# EAGLE design turbo (EAGLE 7.6.0)
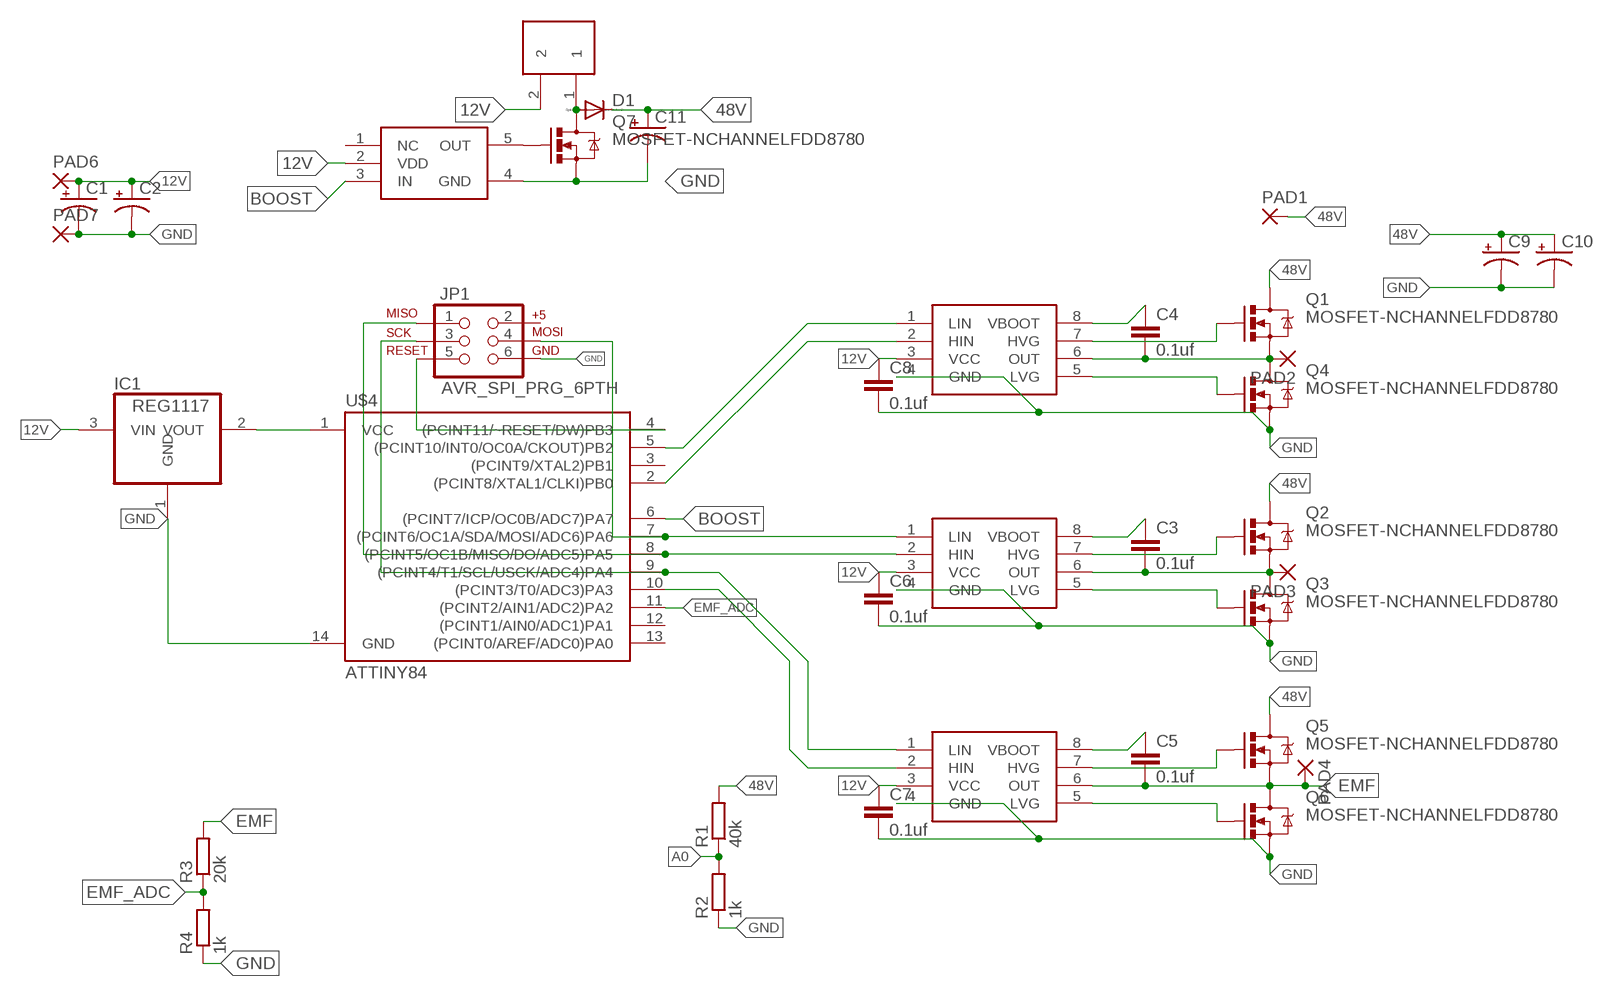
[diagram p0: schematic, sheet 1]

## Parts
C1  CPOL-USE7.5-18  [E7,5-18]
C2  CPOL-USE7.5-18  [E7,5-18]
C3  0.1uf  C-EUC0603  [C0603]
C4  0.1uf  C-EUC0603  [C0603]
C5  0.1uf  C-EUC0603  [C0603]
C6  0.1uf  C-EUC0603  [C0603]
C7  0.1uf  C-EUC0603  [C0603]
C8  0.1uf  C-EUC0603  [C0603]
C9  CPOL-USE7.5-18  [E7,5-18]
C10  CPOL-USE7.5-18  [E7,5-18]
C11  CPOL-USE7.5-18  [E7,5-18]
D1  DIODE-TO220V  [TO220ACS]
IC1  REG1117  [SOT223]
JP1  AVR_SPI_PRG_6PTH  [2X3]
PAD1  WIREPADSMD5-2,5  [5-2,5]
PAD2  WIREPADSMD5-2,5  [5-2,5]
PAD3  WIREPADSMD5-2,5  [5-2,5]
PAD4  WIREPADSMD5-2,5  [5-2,5]
PAD6  WIREPADSMD5-2,5  [5-2,5]
PAD7  WIREPADSMD5-2,5  [5-2,5]
Q1  MOSFET-NCHANNELFDD8780  [DPAK]
Q2  MOSFET-NCHANNELFDD8780  [DPAK]
Q3  MOSFET-NCHANNELFDD8780  [DPAK]
Q4  MOSFET-NCHANNELFDD8780  [DPAK]
Q5  MOSFET-NCHANNELFDD8780  [DPAK]
Q6  MOSFET-NCHANNELFDD8780  [DPAK]
Q7  MOSFET-NCHANNELFDD8780  [DPAK]
R1  40k  R-EU_R0603  [R0603]
R2  1k  R-EU_R0603  [R0603]
R3  20k  R-EU_R0603  [R0603]
R4  1k  R-EU_R0603  [R0603]
U$1  L6387  [SOIC8]
U$2  L6387  [SOIC8]
U$3  L6387  [SOIC8]
U$4  ATTINY84  [SO14]
U$5  2310  [2310]
U$6  MCP1415  [SOT23-5]

## Nets
12V: C1.+ C2.+ C6.1 C7.1 C8.1 IC1.3(VIN) PAD6.1(P) U$1.3(VCC) U$2.3(VCC) U$3.3(VCC) U$5.2 U$6.2(VDD)
48V: C9.+ C10.+ C11.+ D1.C PAD1.1(P) Q1.4(D) Q2.4(D) Q5.4(D) R1.2
A0: R1.1 R2.2
BOOST: U$4.6((PCINT7/ICP/OC0B/ADC7)PA7) U$6.3(IN)
EMF: C5.2 PAD4.1(P) Q5.3(S) Q6.4(D) R3.2 U$3.6(OUT)
EMF_ADC: R3.1 R4.2 U$4.11((PCINT2/AIN1/ADC2)PA2)
GND: C1.- C2.- C6.2 C7.2 C8.2 C9.- C10.- C11.- IC1.1(GND) JP1.6 PAD7.1(P) Q3.3(S) Q4.3(S) Q6.3(S) Q7.3(S) R2.1 R4.1 U$1.4(GND) U$2.4(GND) U$3.4(GND) U$4.14(GND) U$6.4(GND)
N$1: C4.2 PAD2.1(P) Q1.3(S) Q4.4(D) U$1.6(OUT)
N$2: C3.2 PAD3.1(P) Q2.3(S) Q3.4(D) U$2.6(OUT)
N$3: Q3.1(G) U$2.5(LVG)
N$4: Q4.1(G) U$1.5(LVG)
N$5: Q1.1(G) U$1.7(HVG)
N$6: IC1.2(VOUT) U$4.1(VCC)
N$7: C5.1 U$3.8(VBOOT)
N$8: Q2.1(G) U$2.7(HVG)
N$10: Q6.1(G) U$3.5(LVG)
N$11: Q5.1(G) U$3.7(HVG)
N$12: C3.1 U$2.8(VBOOT)
N$13: C4.1 U$1.8(VBOOT)
N$14: JP1.3 U$3.1(LIN) U$4.9((PCINT4/T1/SCL/USCK/ADC4)PA4)
N$15: U$3.2(HIN) U$4.10((PCINT3/T0/ADC3)PA3)
N$16: JP1.1 U$2.2(HIN) U$4.8((PCINT5/OC1B/MISO/DO/ADC5)PA5)
N$17: JP1.4 U$2.1(LIN) U$4.7((PCINT6/OC1A/SDA/MOSI/ADC6)PA6)
N$19: U$1.1(LIN) U$4.5((PCINT10/INT0/OC0A/CKOUT)PB2)
N$20: JP1.5 U$4.4((PCINT11/~RESET/DW)PB3)
N$21: D1.A Q7.4(D) U$5.1
N$22: U$1.2(HIN) U$4.2((PCINT8/XTAL1/CLKI)PB0)
N$23: Q7.1(G) U$6.5(OUT)
Unconnected: JP1.2 U$4.3((PCINT9/XTAL2)PB1) U$4.12((PCINT1/AIN0/ADC1)PA1) U$4.13((PCINT0/AREF/ADC0)PA0) U$6.1(NC)

## Library data of the parts
C1 C2 C9-C11 = adafruit:CPOL-US: POLARIZED CAPACITOR, American symbol
C3-C8 = rcl:C-EU: CAPACITOR, European symbol
D1 = diode:DIODE-: DIODE
IC1 = burr-brown:REG1117: 800mA and 1A Low Dropout (LDO) Positive Regulator 1.8V, 2.5V, 2.85V, 3.3V, 5V, and Adj; MPN: REG1117; OC_FARNELL: 1097566; OC_NEWARK: 14P6981
JP1 = SparkFun-Connectors:AVR_SPI_PRG_6: AVR ISP 6 Pin This is the reduced ISP connector for AVR programming. Common on Arduino. This footprint will take up less PCB space and can be used with a 10-pin to 6-pin adapter such as SKU: BOB-08508 **Special note about "TEST_POINT" package. The stop mask is on the top side, so if you want your programming test points to be on the bottom of your board, make sure to place this package on the bottom side of the board. This also ensure that the orientation to program from the bottom side will be correct.
PAD1-PAD4 PAD6 PAD7 = wirepad:WIREPAD: Wire PAD connect wire on PCB
Q1-Q7 = SparkFun-DiscreteSemi:MOSFET-NCHANNEL: Common NMOSFET Parts MFG P/N Store ID Prod ID FDD8780 TRANS-09984 SI7820DN TRANS-11055 FDS6630A IC-08089 2N7002PW TRANS-11151 FQP30N06L COM-10213 TRANS-10060 BSS123LT1G TRANS-08345 BSS138 TRANS-00830 BS170 2N7000; PROD_ID: TRANS-09984
R1-R4 = rcl:R-EU_: RESISTOR, European symbol
U$1-U$3 = TheLibrary:L6387
U$4 = SparkFun-DigitalIC:ATTINY84: Atmel 14-pin 2/4/8kB flash uC; PROD_ID: IC-11285
U$5 = TheLibrary:2310
U$6 = TheLibrary:MCP1415

## Net classes
0 default: width 0.635 mm

## Board
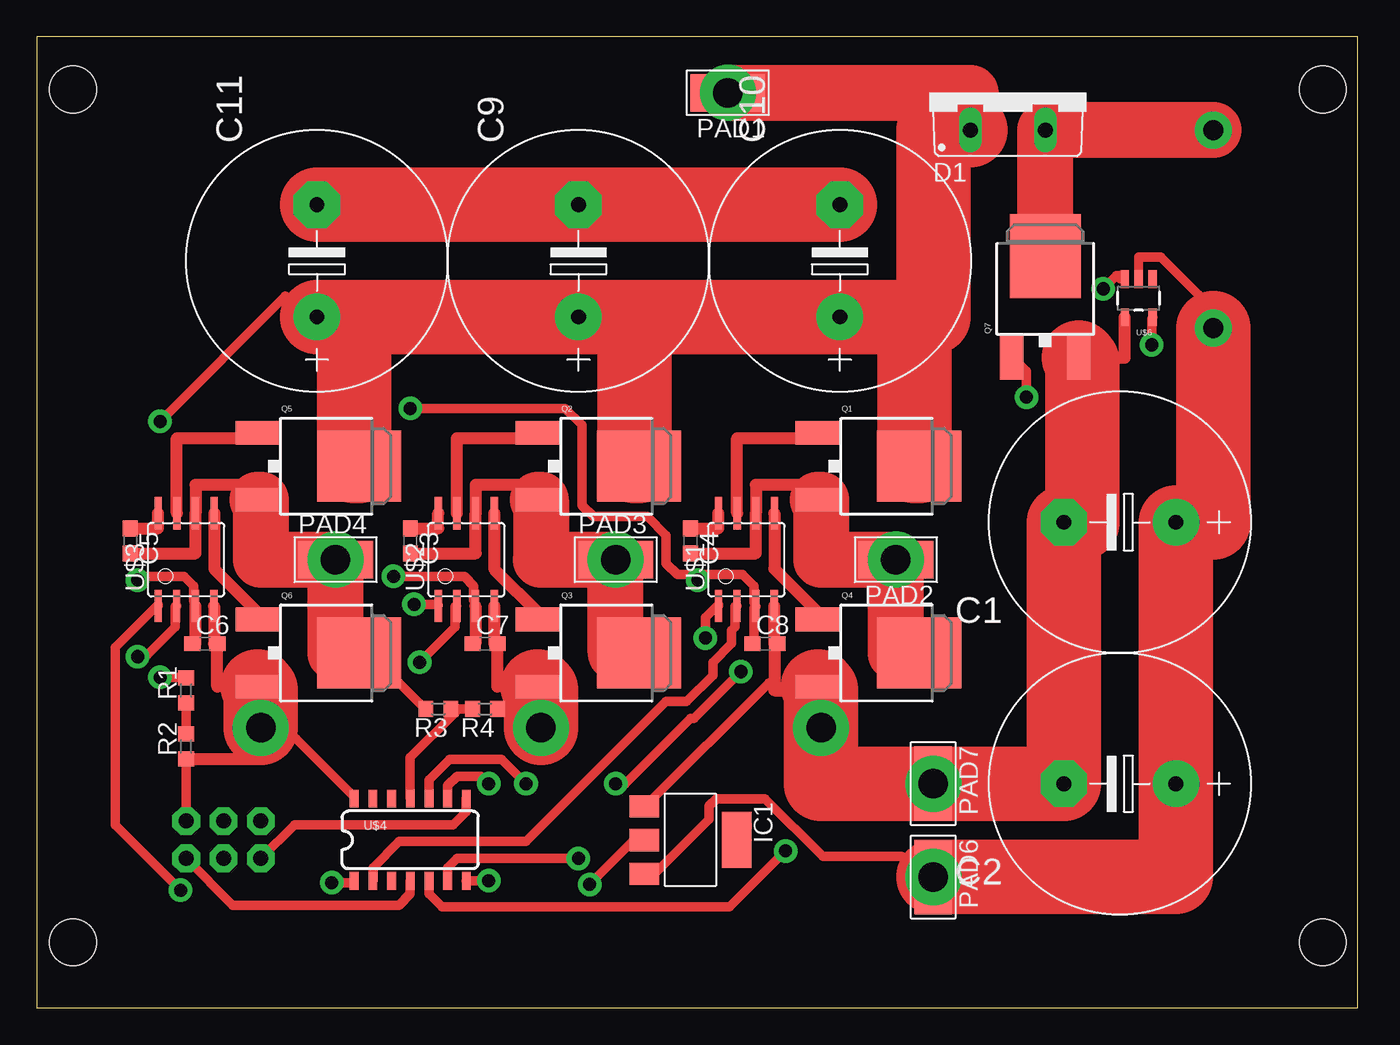
[diagram p1: board, top side]
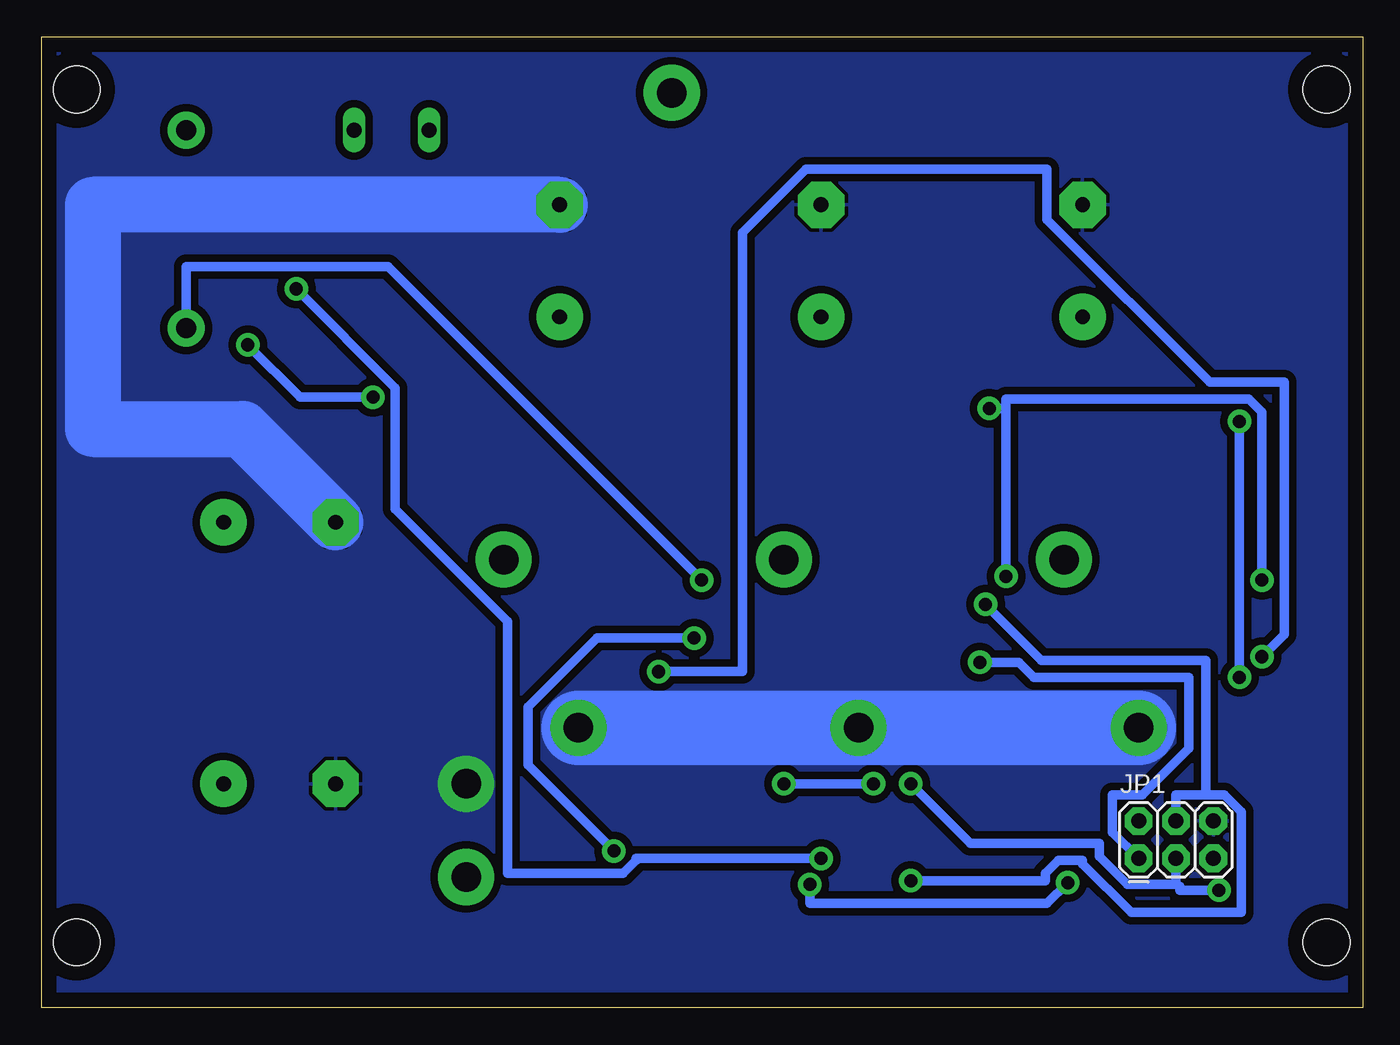
[diagram p2: board, bottom side, seen from below]

Size 89.84 x 66.03 mm. Coordinates in mm from the lower left corner, seen from the top.
Outline: 0,0 89.84,0 89.84,66.03 0,66.03 0,0
Copper layers (1*16): Top 0.035mm / dielectric 1.5mm / Bottom 0.035mm
Design rules "default *": minimum track width 20mil, minimum drill 35mil, track to track 20mil, track to pad 20mil, pad to pad 20mil, via to via 20mil, smd to smd 20mil, copper to edge 40mil, drill to drill 13mil, minimum pad ring 10mil, minimum via ring 8mil, stop-mask expansion 4mil, vias tented up to drill 0mil, thermal gap 10mil
Holes 3.17 mm at 2.46,62.46 2.46,4.46 87.46,62.46 87.46,4.46
vRestrict: area 21,9.5 to 29.8,13.3; area 7.6,27.9 to 12.7,33; area 26.7,27.9 to 31.7,33; area 45.7,27.9 to 50.8,33; area 54.6,33.7 to 61,40; area 35.6,33.7 to 41.9,40; area 35.6,21 to 41.9,27.3; area 54.6,21 to 61,27.3; area 16.5,21 to 22.9,27.3; area 42.5,8.3 to 46.4,14.6; area 73.7,47.6 to 76.2,48.9; area 65.4,45.7 to 71.8,52.1; 1 more areas

### Footprints (pad centres in the part's own frame; a part is rotated, then mirrored left to right if it is on the bottom)
E7,5-18 = drill 1.016 pad 3.15: + -3.81,0 | drill 1.016 pad 3.15 octagon: - 3.81,0
C0603 = smd 1.1 x 1: 1 -0.85,0; 2 0.85,0
TO220ACS = drill 1.016 long: A 2.54,-2.54; C -2.54,-2.54
SOT223 = smd 1.499 x 2.007: 1 -2.261,-3.15; 2 0.025,-3.15; 3 2.311,-3.15 | smd 3.81 x 2.007: 4 0,3.15
2X3 = drill 1.016 pad 1.88 octagon: 1 0,0; 2 0,2.54; 3 2.54,0; 4 2.54,2.54; 5 5.08,0; 6 5.08,2.54
5-2,5 = smd 2.54 x 5.08: 1 0,0
DPAK = smd 1.6 x 3: 1 -2.28,-5.31; 3 2.28,-5.31 | smd 4.826 x 5.715: 4 0,1.588
R0603 = smd 1 x 1.1: 1 -0.85,0; 2 0.85,0
SOIC8 = smd 0.5 x 2.2: 1 -1.905,-3.154; 2 -0.645,-3.154; 3 0.625,-3.154; 4 1.895,-3.154; 5 1.905,3.154; 6 0.635,3.154; 7 -0.635,3.154; 8 -1.905,3.154
SO14 = smd 0.6 x 1.2: 1 -3.81,-2.8; 2 -2.54,-2.8; 3 -1.27,-2.8; 4 0,-2.8; 5 1.27,-2.8; 6 2.54,-2.8; 7 3.81,-2.8; 8 3.81,2.8; 9 2.54,2.8; 10 1.27,2.8; 11 0,2.8; 12 -1.27,2.8; 13 -2.54,2.8; 14 -3.81,2.8
2310 = drill 1.346 pad 2.54: 1 0,0; 2 13.462,0
SOT23-5 = smd 0.55 x 1.2: 1 -0.95,-1.3; 2 0,-1.3; 3 0.95,-1.3; 4 0.95,1.3; 5 -0.95,1.3

### Placement (x,y rotation side)
C1  73.66,33.02 180 top
C2  73.66,15.24 180 top
C3  25.4,31.75 270 top
C4  44.45,31.75 270 top
C5  6.35,31.75 270 top
C6  11.43,24.77 0 top
C7  30.48,24.77 0 top
C8  49.53,24.77 0 top
C9  36.83,50.8 90 top
C10  54.61,50.8 90 top
C11  19.05,50.8 90 top
D1  66.04,62.23 0 top
IC1  44.45,11.43 270 top
JP1  15.24,10.16 0 bottom
PAD1  46.99,62.23 90 top
PAD2  58.42,30.48 90 top
PAD3  39.37,30.48 270 top
PAD4  20.32,30.48 270 top
PAD6  60.96,8.89 180 top
PAD7  60.96,15.24 180 top
Q1  58.42,36.83 270 top
Q2  39.37,36.83 270 top
Q3  39.37,24.13 270 top
Q4  58.42,24.13 270 top
Q5  20.32,36.83 270 top
Q6  20.32,24.13 270 top
Q7  68.58,49.53 0 top
R1  10.16,21.59 90 top
R2  10.16,17.78 90 top
R3  27.3,20.32 180 top
R4  30.48,20.32 180 top
U$1  48.26,30.48 0 top
U$2  29.21,30.48 0 top
U$3  10.16,30.48 0 top
U$4  25.4,11.43 0 top
U$5  80.01,59.69 270 top
U$6  74.93,48.26 180 top

### Tracks (layer width: path | path; a pad name or v marks a point on that pad's centre or on a via)
12V  (via drill 0.89, 2 pad 3.81)
  Top 0.61: U$6.2 74.93,51.05
  Top 0.635: C8.1 48.77,24.77 48.77,27.18 48.9,27.3 U$1.3 48.77,27.56 48.77,28.7 48.01,29.46 44.96,29.46 | v6.86,29.08 7.11,29.34 10.03,29.34 10.67,28.7 10.67,27.69 U$3.3 | v24.26,29.34 29.08,29.34 29.72,28.7 29.72,27.69 U$2.3 | 44.96,29.46 43.56,29.46 42.8,30.23 42.8,32.13 41.53,33.4 37.85,33.4 37.08,34.16 37.08,39.62 35.94,40.77 v25.4,40.77 | 74.93,51.05 76.45,51.05 78.99,48.51 U$5.2 | IC1.3 41.4,9.14 42.04,9.14 45.72,12.83 45.72,13.72 46.23,14.22 49.53,14.22 53.47,10.29 58.8,10.29 PAD6.1 | v44.96,29.08 44.96,29.46
  Top 0.813: U$3.3 10.79,24.77 C6.1 | U$2.3 29.84,24.77 C7.1
  Top 5.08: PAD6.1 77.47,8.89 C2.+ C1.+ 80.01,33.02 U$5.2
  Bottom 0.635: v6.86,29.08 6.86,40.51 7.75,41.4 24.26,41.4 24.26,40.77 | v24.26,29.34 24.26,40.77 | 24.26,40.77 v25.4,40.77 | v44.96,29.08 66.29,50.42 80.01,50.42 U$5.2
  other vias: 60.96,8.89
48V  (via drill 0.89, 2 pad 3.81)
  Top 0.635: v8.38,22.48 10.16,22.48 R1.2 | v8.38,39.88 16.89,48.39 C11.+
  Top 3.81: Q5.4 22.86,36.83 | PAD1.1 63.5,62.23 D1.C
  Top 5.08: 59.69,46.99 60.96,46.99 60.96,59.69 D1.C | 59.69,46.99 C10.+ 40.64,46.99 | C11.+ 21.59,46.99 | 21.59,46.99 C9.+ 40.64,46.99 | Q1.4 59.69,36.83 59.69,46.99 | Q2.4 40.64,36.83 40.64,46.99 | Q5.4 21.59,36.83 21.59,46.99
  Bottom 0.635: v8.38,39.88 v8.38,22.48
  other vias: 46.99,62.23
A0
  Top 0.635: R1.1 R2.2
BOOST  (via drill 0.89)
  Top 0.61: U$6.3 73.66,49.56 73.66,49.78
  Top 0.635: U$4.6 27.94,9.52 28.57,10.16 v36.83,10.16 | v72.52,48.89 73.41,49.78 73.66,49.78
  Bottom 0.635: v36.83,10.16 49.4,10.16 49.4,10.03 50.29,9.14 58.17,9.14 58.17,26.29 65.79,33.91 65.79,42.16 v72.52,48.89
EMF  (via drill 2 pad 3.81)
  Top 0.635: R3.2 26.42,20.32 23.5,23.24 Q6.4
  Top 0.813: Q5.3 15.01,35.56 10.79,35.56 U$3.6 10.79,30.9 C5.2
  Top 3.81: Q6.4 20.32,24.13 PAD4.1 15.24,30.48 15.24,34.55 Q5.3
  other vias: 20.32,30.48
EMF_ADC
  Top 0.635: R4.2 R3.1 28.45,20.07 25.4,17.02 U$4.11
GND  (via drill 2 pad 3.81)
  Top 0.635: R4.1 34.29,20.32 | U$4.14 21.59,14.35 17.65,18.29 v15.24,19.05 | IC1.1 41.4,13.72 49.78,22.1 50.17,22.1 | R2.1 JP1.6
  Top 0.813: U$3.4 12.05,24.77 C6.2 12.28,21.85 Q6.3 | U$2.4 31.11,24.77 C7.2 31.33,21.85 Q3.3 | U$1.4 50.16,24.77 C8.2 50.17,24.77 50.17,22.1 50.17,21.59 53.11,21.59 Q4.3 | R2.1 15.24,16.93 v15.24,19.05 | Q7.3 73.98,44.22 U$6.4
  Top 5.08: C10.- C9.- C11.- | Q7.3 71.12,43.96 71.12,33.02 C1.- C2.- PAD7.1 53.34,15.24 v53.34,19.05 53.34,21.62 Q4.3 | Q3.3 34.29,21.62 34.29,20.32 v34.29,19.05 | Q6.3 15.24,21.62 v15.24,19.05
  Bottom 3.81: C10.- 86.36,54.61 86.36,39.37 76.2,39.37 C1.-
  Bottom 5.08: v53.34,19.05 v34.29,19.05 v15.24,19.05
  other vias: 60.96,15.24
  pour Bottom (isolate 0.025, rank 6): 0,66.04 0,0 90.17,0 90.17,66.04
N$1  (via drill 2 pad 3.81)
  Top 0.813: C4.2 48.9,30.9 U$1.6 48.9,35.56 53.34,35.56 53.34,34.55
  Top 3.81: Q4.4 58.42,24.13 PAD2.1 53.34,30.48 53.34,34.55 Q1.3
  other vias: 58.42,30.48
N$2  (via drill 2 pad 3.81)
  Top 0.813: Q2.3 34.06,35.56 29.84,35.56 U$2.6 29.84,30.9 C3.2
  Top 3.81: Q3.4 39.37,24.13 PAD3.1 34.29,30.48 34.29,34.55 Q2.3
  other vias: 39.37,30.48
N$3
  Top 0.813: U$2.5 31.11,29.85 34.29,26.67 34.29,26.64 Q3.1
N$4
  Top 0.813: U$1.5 50.17,29.85 53.34,26.67 53.34,26.64 Q4.1
N$5
  Top 0.813: U$1.7 47.62,38.73 53.11,38.73 Q1.1
N$6  (via drill 0.89)
  Top 0.635: v20.07,8.51 21.59,8.51 U$4.1 | v37.59,8.38 40.51,11.3 41.28,11.3 IC1.2
  Bottom 0.635: v20.07,8.51 21.46,7.11 37.59,7.11 v37.59,8.38
N$7
  Top 0.813: C5.1 8.26,32.6 U$3.8
N$8
  Top 0.813: U$2.7 28.57,38.73 34.29,38.73 34.29,39.37 34.06,39.37 Q2.1
N$10
  Top 0.813: U$3.5 12.06,29.85 15.24,26.67 15.24,26.64 Q6.1
N$11
  Top 0.813: U$3.7 9.53,38.73 15.01,38.73 Q5.1
N$12
  Top 0.813: C3.1 27.3,32.6 U$2.8
N$13
  Top 0.813: C4.1 46.36,32.6 U$1.8
N$14  (via drill 0.89)
  Top 0.635: U$4.9 27.94,15.11 28.57,15.75 30.23,15.75 v30.73,15.24 | v9.78,8 5.33,12.45 5.33,24.51 8.26,27.43 U$3.1
  Bottom 0.635: v30.73,15.24 26.67,11.18 17.91,11.18 17.91,10.29 16,8.38 12.7,8.38 | JP1.3 12.7,8.38 | v9.78,8 12.45,8 12.45,8.25 12.7,8.38
N$15  (via drill 0.89)
  Top 0.635: U$4.10 26.67,15.49 28.07,16.89 31.62,16.89 v33.27,15.24 | v39.37,15.24 40.01,15.24 44.45,19.69 44.7,19.69 v47.88,22.86 | v6.86,23.88 7.37,23.88 9.4,25.91 9.4,27.3 U$3.2
  Bottom 0.635: v39.37,15.24 v33.27,15.24 | v47.88,22.86 42.16,22.86 42.16,52.7 37.85,57.02 21.46,57.02 21.46,53.59 10.41,42.54 5.33,42.54 5.33,25.4 v6.86,23.88
N$16  (via drill 0.89)
  Top 0.635: U$4.8 29.21,13.34 28.32,12.45 17.53,12.45 JP1.1 | v26.04,23.5 28.45,25.91 28.45,27.3 U$2.2
  Bottom 0.635: v26.04,23.5 23.37,23.5 22.35,22.48 11.81,22.48 11.81,17.65 14.99,14.48 17.02,14.48 17.02,11.94 JP1.1
N$17  (via drill 0.89)
  Top 0.635: v30.73,8.64 U$4.7 | v25.65,27.43 27.3,27.43 U$2.1
  Bottom 0.635: v30.73,8.64 21.59,8.64 21.59,9.14 20.7,10.03 19.05,10.03 19.05,9.78 15.75,6.48 8.26,6.48 8.26,13.34 9.4,14.48 10.67,14.48 | 10.67,14.48 12.7,14.48 JP1.4 | v25.65,27.43 21.84,23.62 10.67,23.62 10.67,14.48
N$19  (via drill 0.89)
  Top 0.635: U$4.5 26.67,7.75 27.56,6.86 47.12,6.86 v50.93,10.67 | v45.47,25.15 45.47,26.54 46.36,27.43 U$1.1
  Bottom 0.635: v50.93,10.67 56.77,16.51 56.77,20.45 52.07,25.15 v45.47,25.15
N$20
  Top 0.635: U$4.4 25.4,7.75 24.64,6.98 13.33,6.98 JP1.5
N$21
  Top 3.81: Q7.4 D1.A U$5.1
N$22
  Top 0.635: U$4.2 22.86,9.52 24.64,11.3 33.27,11.3 42.8,20.83 44.2,20.83 45.97,22.61 45.97,23.5 47.24,24.77 47.24,25.65 47.5,25.91 47.5,27.3 U$1.2
N$23  (via drill 0.89)
  Top 0.635: v75.82,45.08 75.82,46.86 U$6.5 | v67.31,41.53 67.31,43.31 66.42,44.2 Q7.1
  Bottom 0.635: v75.82,45.08 72.26,41.53 v67.31,41.53